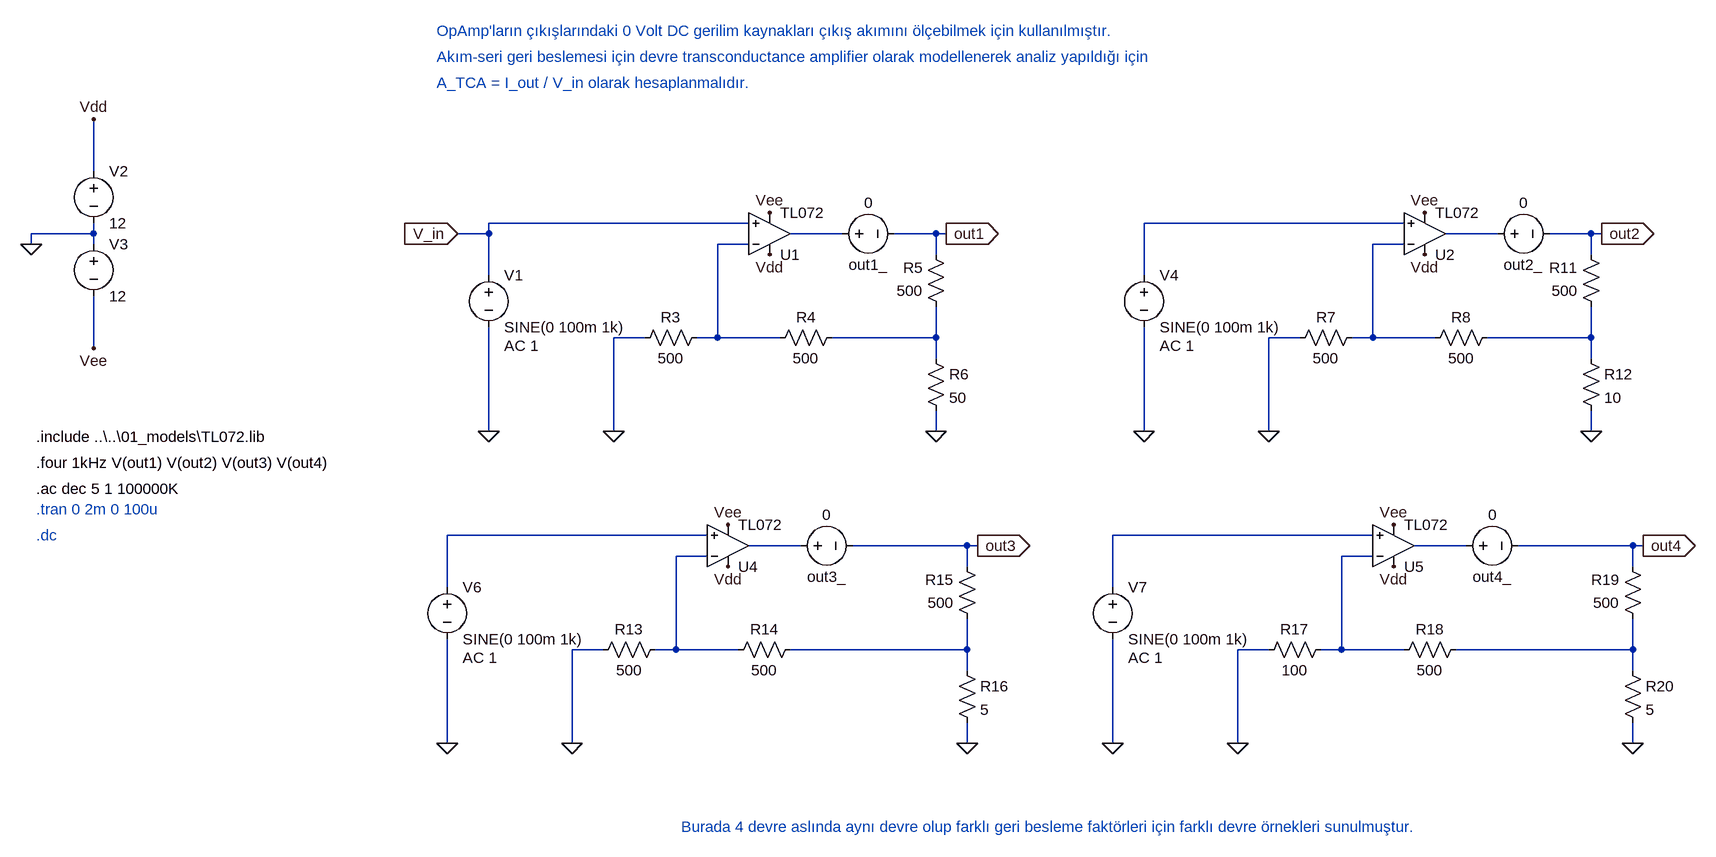
[diagram p0: schematic fb_curser.asc]
fb_curser.asc, the LTspice schematic file:
Version 4
SHEET 1 3184 1072
WIRE -256 48 -256 -32
WIRE 752 128 352 128
WIRE 1760 128 1360 128
WIRE -256 144 -256 128
WIRE -256 144 -352 144
WIRE 352 144 352 128
WIRE 352 144 304 144
WIRE 896 144 816 144
WIRE 1040 144 976 144
WIRE 1056 144 1040 144
WIRE 1904 144 1824 144
WIRE 2048 144 1984 144
WIRE 2064 144 2048 144
WIRE -352 160 -352 144
WIRE -256 160 -256 144
WIRE 752 160 704 160
WIRE 1760 160 1712 160
WIRE 1040 176 1040 144
WIRE 2048 176 2048 144
WIRE 352 208 352 144
WIRE 1360 208 1360 128
WIRE 592 304 544 304
WIRE 704 304 704 160
WIRE 704 304 672 304
WIRE 800 304 704 304
WIRE 1040 304 1040 256
WIRE 1040 304 880 304
WIRE 1600 304 1552 304
WIRE 1712 304 1712 160
WIRE 1712 304 1680 304
WIRE 1808 304 1712 304
WIRE 2048 304 2048 256
WIRE 2048 304 1888 304
WIRE -256 320 -256 240
WIRE 1040 336 1040 304
WIRE 2048 336 2048 304
WIRE 352 448 352 288
WIRE 544 448 544 304
WIRE 1040 448 1040 416
WIRE 1360 448 1360 288
WIRE 1552 448 1552 304
WIRE 2048 448 2048 416
WIRE 688 608 288 608
WIRE 1712 608 1312 608
WIRE 832 624 752 624
WIRE 1088 624 912 624
WIRE 1104 624 1088 624
WIRE 1856 624 1776 624
WIRE 2112 624 1936 624
WIRE 2128 624 2112 624
WIRE 688 640 640 640
WIRE 1712 640 1664 640
WIRE 1088 656 1088 624
WIRE 2112 656 2112 624
WIRE 288 688 288 608
WIRE 1312 688 1312 608
WIRE 528 784 480 784
WIRE 640 784 640 640
WIRE 640 784 608 784
WIRE 736 784 640 784
WIRE 1088 784 1088 736
WIRE 1088 784 816 784
WIRE 1552 784 1504 784
WIRE 1664 784 1664 640
WIRE 1664 784 1632 784
WIRE 1760 784 1664 784
WIRE 2112 784 2112 736
WIRE 2112 784 1840 784
WIRE 1088 816 1088 784
WIRE 2112 816 2112 784
WIRE 288 928 288 768
WIRE 480 928 480 784
WIRE 1088 928 1088 896
WIRE 1312 928 1312 768
WIRE 1504 928 1504 784
WIRE 2112 928 2112 896
FLAG -352 160 0
FLAG -256 -32 Vdd
FLAG -256 320 Vee
FLAG 352 448 0
FLAG 544 448 0
FLAG 784 176 Vdd
FLAG 784 112 Vee
FLAG 1040 448 0
FLAG 1360 448 0
FLAG 1552 448 0
FLAG 1792 176 Vdd
FLAG 1792 112 Vee
FLAG 2048 448 0
FLAG 1056 144 out1
IOPIN 1056 144 Out
FLAG 2064 144 out2
IOPIN 2064 144 Out
FLAG 288 928 0
FLAG 480 928 0
FLAG 720 656 Vdd
FLAG 720 592 Vee
FLAG 1088 928 0
FLAG 1312 928 0
FLAG 1504 928 0
FLAG 1744 656 Vdd
FLAG 1744 592 Vee
FLAG 2112 928 0
FLAG 1104 624 out3
IOPIN 1104 624 Out
FLAG 2128 624 out4
IOPIN 2128 624 Out
FLAG 304 144 V_in
IOPIN 304 144 In
SYMBOL voltage -256 32 R0
WINDOW 123 0 0 Left 0
WINDOW 39 0 0 Left 0
SYMATTR InstName V2
SYMATTR Value 12
SYMBOL voltage -256 144 R0
WINDOW 123 0 0 Left 0
WINDOW 39 0 0 Left 0
SYMATTR InstName V3
SYMATTR Value 12
SYMBOL res 688 288 R90
WINDOW 0 0 56 VBottom 2
WINDOW 3 32 56 VTop 2
SYMATTR InstName R3
SYMATTR Value 500
SYMBOL res 896 288 R90
WINDOW 0 0 56 VBottom 2
WINDOW 3 32 56 VTop 2
SYMATTR InstName R4
SYMATTR Value 500
SYMBOL res 1056 272 R180
WINDOW 0 36 76 Left 2
WINDOW 3 36 40 Left 2
SYMATTR InstName R5
SYMATTR Value 500
SYMBOL voltage 352 192 R0
WINDOW 123 24 124 Left 2
WINDOW 39 0 0 Left 0
SYMATTR Value2 AC 1
SYMATTR InstName V1
SYMATTR Value SINE(0 100m 1k)
SYMBOL OpAmps\\opamp2 784 208 M180
SYMATTR InstName U1
SYMATTR Value TL072
SYMBOL res 1024 320 R0
SYMATTR InstName R6
SYMATTR Value 50
SYMBOL voltage 880 144 R270
WINDOW 0 -32 56 VBottom 2
WINDOW 3 32 56 VTop 2
WINDOW 123 0 0 Left 0
WINDOW 39 0 0 Left 0
SYMATTR InstName out1_
SYMATTR Value 0
SYMBOL res 1696 288 R90
WINDOW 0 0 56 VBottom 2
WINDOW 3 32 56 VTop 2
SYMATTR InstName R7
SYMATTR Value 500
SYMBOL res 1904 288 R90
WINDOW 0 0 56 VBottom 2
WINDOW 3 32 56 VTop 2
SYMATTR InstName R8
SYMATTR Value 500
SYMBOL res 2064 272 R180
WINDOW 0 36 76 Left 2
WINDOW 3 36 40 Left 2
SYMATTR InstName R11
SYMATTR Value 500
SYMBOL voltage 1360 192 R0
WINDOW 123 24 124 Left 2
WINDOW 39 0 0 Left 0
SYMATTR Value2 AC 1
SYMATTR InstName V4
SYMATTR Value SINE(0 100m 1k)
SYMBOL OpAmps\\opamp2 1792 208 M180
SYMATTR InstName U2
SYMATTR Value TL072
SYMBOL res 2032 320 R0
SYMATTR InstName R12
SYMATTR Value 10
SYMBOL voltage 1888 144 R270
WINDOW 0 -32 56 VBottom 2
WINDOW 3 32 56 VTop 2
WINDOW 123 0 0 Left 0
WINDOW 39 0 0 Left 0
SYMATTR InstName out2_
SYMATTR Value 0
SYMBOL res 624 768 R90
WINDOW 0 0 56 VBottom 2
WINDOW 3 32 56 VTop 2
SYMATTR InstName R13
SYMATTR Value 500
SYMBOL res 832 768 R90
WINDOW 0 0 56 VBottom 2
WINDOW 3 32 56 VTop 2
SYMATTR InstName R14
SYMATTR Value 500
SYMBOL res 1104 752 R180
WINDOW 0 36 76 Left 2
WINDOW 3 36 40 Left 2
SYMATTR InstName R15
SYMATTR Value 500
SYMBOL voltage 288 672 R0
WINDOW 123 24 124 Left 2
WINDOW 39 0 0 Left 0
SYMATTR Value2 AC 1
SYMATTR InstName V6
SYMATTR Value SINE(0 100m 1k)
SYMBOL OpAmps\\opamp2 720 688 M180
SYMATTR InstName U4
SYMATTR Value TL072
SYMBOL res 1072 800 R0
SYMATTR InstName R16
SYMATTR Value 5
SYMBOL voltage 816 624 R270
WINDOW 0 -32 56 VBottom 2
WINDOW 3 32 56 VTop 2
WINDOW 123 0 0 Left 0
WINDOW 39 0 0 Left 0
SYMATTR InstName out3_
SYMATTR Value 0
SYMBOL res 1648 768 R90
WINDOW 0 0 56 VBottom 2
WINDOW 3 32 56 VTop 2
SYMATTR InstName R17
SYMATTR Value 100
SYMBOL res 1856 768 R90
WINDOW 0 0 56 VBottom 2
WINDOW 3 32 56 VTop 2
SYMATTR InstName R18
SYMATTR Value 500
SYMBOL res 2128 752 R180
WINDOW 0 36 76 Left 2
WINDOW 3 36 40 Left 2
SYMATTR InstName R19
SYMATTR Value 500
SYMBOL voltage 1312 672 R0
WINDOW 123 24 124 Left 2
WINDOW 39 0 0 Left 0
SYMATTR Value2 AC 1
SYMATTR InstName V7
SYMATTR Value SINE(0 100m 1k)
SYMBOL OpAmps\\opamp2 1744 688 M180
SYMATTR InstName U5
SYMATTR Value TL072
SYMBOL res 2096 800 R0
SYMATTR InstName R20
SYMATTR Value 5
SYMBOL voltage 1840 624 R270
WINDOW 0 -32 56 VBottom 2
WINDOW 3 32 56 VTop 2
WINDOW 123 0 0 Left 0
WINDOW 39 0 0 Left 0
SYMATTR InstName out4_
SYMATTR Value 0
TEXT -344 536 Left 2 !.ac dec 5 1 100000K
TEXT -344 608 Left 2 ;.dc
TEXT -344 456 Left 2 !.include ..\\..\\01_models\\TL072.lib
TEXT -344 496 Left 2 !.four 1kHz V(out1) V(out2) V(out3) V(out4)
TEXT -344 568 Left 2 ;.tran 0 2m 0 100u
TEXT 272 -168 Left 2 ;OpAmp'ların çıkışlarındaki 0 Volt DC gerilim kaynakları çıkış akımını ölçebilmek için kullanılmıştır.
TEXT 272 -128 Left 2 ;Akım-seri geri beslemesi için devre transconductance amplifier olarak modellenerek analiz yapıldığı için
TEXT 272 -88 Left 2 ;A_TCA = I_out / V_in olarak hesaplanmalıdır.
TEXT 648 1056 Left 2 ;Burada 4 devre aslında aynı devre olup farklı geri besleme faktörleri için farklı devre örnekleri sunulmuştur.

The netlist it stands for:
* fb_curser.asc
V2 Vdd 0 12
V3 0 Vee 12
R3 N004 0 500
R4 N006 N004 500
R5 N006 out1 500
V1 V_in 0 SINE(0 100m 1k) AC 1
XU1 V_in N004 Vdd Vee N002 TL072  ; pins In+ In- V+ V- OUT
R6 N006 0 50
V§out1_ N002 out1 0
R7 N005 0 500
R8 N007 N005 500
R11 N007 out2 500
V4 N001 0 SINE(0 100m 1k) AC 1
XU2 N001 N005 Vdd Vee N003 TL072  ; pins In+ In- V+ V- OUT
R12 N007 0 10
V§out2_ N003 out2 0
R13 N012 0 500
R14 N014 N012 500
R15 N014 out3 500
V6 N008 0 SINE(0 100m 1k) AC 1
XU4 N008 N012 Vdd Vee N010 TL072  ; pins In+ In- V+ V- OUT
R16 N014 0 5
V§out3_ N010 out3 0
R17 N013 0 100
R18 N015 N013 500
R19 N015 out4 500
V7 N009 0 SINE(0 100m 1k) AC 1
XU5 N009 N013 Vdd Vee N011 TL072  ; pins In+ In- V+ V- OUT
R20 N015 0 5
V§out4_ N011 out4 0
.ac dec 5 1 100000K
* .dc
.include ..\..\01_models\TL072.lib
.four 1kHz V(out1) V(out2) V(out3) V(out4)
* .tran 0 2m 0 100u
* OpAmp'ların çıkışlarındaki 0 Volt DC gerilim kaynakları çıkış akımını ölçebilmek için kullanılmıştır.
* Akım-seri geri beslemesi için devre transconductance amplifier olarak modellenerek analiz yapıldığı için
* A_TCA = I_out / V_in olarak hesaplanmalıdır.
* Burada 4 devre aslında aynı devre olup farklı geri besleme faktörleri için farklı devre örnekleri sunulmuştur.
.backanno
.end